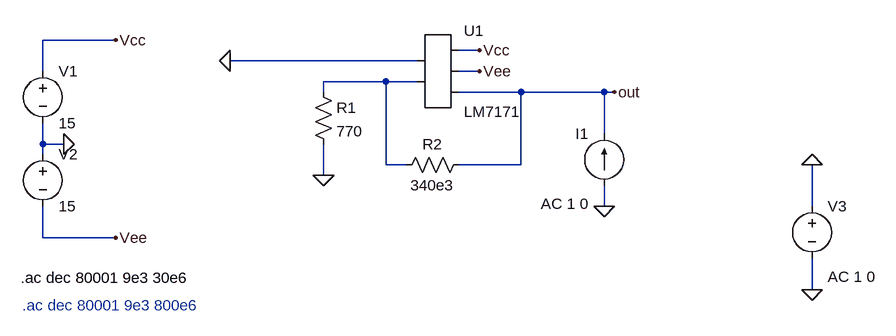
[diagram p0: schematic LM7171_Sim_model.asc]
LM7171_Sim_model.asc, the LTspice schematic file:
Version 4
SHEET 1 1044 680
WIRE -128 128 -240 128
WIRE 432 144 400 144
WIRE 336 160 48 160
WIRE -240 176 -240 128
WIRE 432 176 400 176
WIRE 288 192 192 192
WIRE 336 192 288 192
WIRE 192 208 192 192
WIRE 496 208 400 208
WIRE 624 208 496 208
WIRE 640 208 624 208
WIRE 624 272 624 208
WIRE -240 288 -240 256
WIRE -208 288 -240 288
WIRE -240 304 -240 288
WIRE 288 320 288 192
WIRE 320 320 288 320
WIRE 496 320 496 208
WIRE 496 320 400 320
WIRE 192 336 192 288
WIRE 624 384 624 352
WIRE 944 384 944 320
WIRE -240 432 -240 384
WIRE -128 432 -240 432
WIRE 944 512 944 464
FLAG -208 288 0
FLAG -128 128 Vcc
FLAG -128 432 Vee
FLAG 432 144 Vcc
FLAG 432 176 Vee
FLAG 944 512 0
FLAG 192 336 0
FLAG 640 208 out
FLAG 944 320 0
FLAG 624 384 0
FLAG 48 160 0
SYMBOL voltage -240 160 R0
WINDOW 123 0 0 Left 0
WINDOW 39 0 0 Left 0
SYMATTR InstName V1
SYMATTR Value 15
SYMBOL voltage -240 288 R0
WINDOW 123 0 0 Left 0
WINDOW 39 0 0 Left 0
SYMATTR InstName V2
SYMATTR Value 15
SYMBOL voltage 944 368 R0
WINDOW 123 24 124 Left 2
WINDOW 39 0 0 Left 0
SYMATTR InstName V3
SYMATTR Value ""
SYMATTR Value2 AC 1 0
SYMBOL res 176 192 R0
SYMATTR InstName R1
SYMATTR Value 770
SYMBOL res 416 304 R90
WINDOW 0 0 56 VBottom 2
WINDOW 3 32 56 VTop 2
SYMATTR InstName R2
SYMATTR Value 340e3
SYMBOL AutoGenerated\\LM7171 368 176 R0
SYMATTR InstName U1
SYMBOL current 624 352 R180
WINDOW 0 24 80 Left 2
WINDOW 3 24 0 Left 2
WINDOW 123 24 -28 Left 2
WINDOW 39 0 0 Left 0
SYMATTR InstName I1
SYMATTR Value ""
SYMATTR Value2 AC 1 0
TEXT -274 494 Left 2 !.ac dec 80001 9e3 30e6
TEXT -272 536 Left 2 ;.ac dec 80001 9e3 800e6

The netlist it stands for:
* LM7171_Sim_model.asc
V1 Vcc 0 15
V2 0 Vee 15
V3 0 0 AC 1 0
R1 N001 0 770
R2 out N001 340e3
* U1: LM7171 (symbol AutoGenerated\LM7171 not available, pins judged from their places): pin1=0 pin2=N001 pin3=Vcc pin4=Vee pin5=out
I1 0 out AC 1 0
.ac dec 80001 9e3 30e6
* .ac dec 80001 9e3 800e6
.backanno
.end